# EAGLE design ps2st mouse v3 (EAGLE 7.4.0)
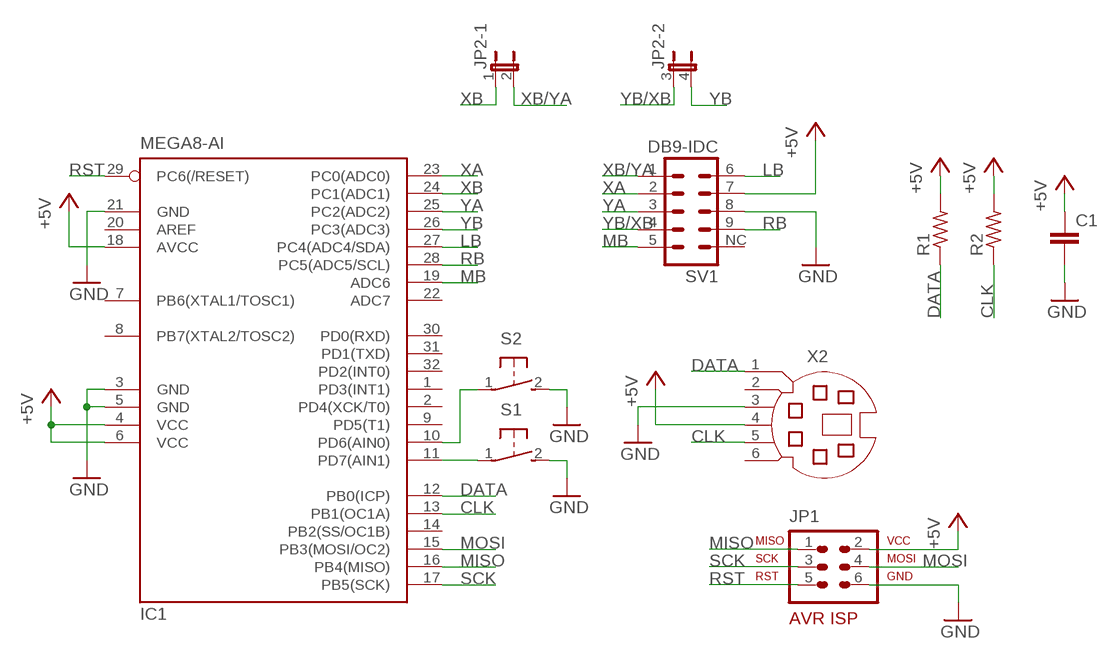
[diagram p0: schematic, sheet 1]

## Parts
C1  C-EUC0805  [C0805]
IC1  MEGA8-AI  [TQFP32-08]
JP1  AVR-ISP-6VERT  [AVR-ISP-6]
JP2  JP2QE  [JP2Q]
R1  R-US_R0805  [R0805]
R2  R-US_R0805  [R0805]
S1  3X6SWITCH  [3X6]
S2  3X6SWITCH  [3X6]
SV1  DB9-IDC  [DB9]
X2  MD06SS  [MDIN06SS]

## Nets
+5V [power]: C1.1 IC1.4(VCC) IC1.6(VCC) IC1.18(AVCC) JP1.2 R1.2 R2.2 SV1.7 X2.4
CLK: IC1.13(PB1(OC1A)) R2.1 X2.5
DATA: IC1.12(PB0(ICP)) R1.1 X2.1
GND [power]: C1.2 IC1.3(GND) IC1.5(GND) IC1.21(GND) JP1.6 S1.2(S) S2.2(S) SV1.8 X2.3
LB: IC1.27(PC4(ADC4/SDA)) SV1.6
MB [power]: IC1.19(ADC6) SV1.5
MISO: IC1.16(PB4(MISO)) JP1.1
MOSI: IC1.15(PB3(MOSI/OC2)) JP1.4
N$1: IC1.11(PD7(AIN1)) S1.1(P)
N$2: IC1.10(PD6(AIN0)) S2.1(P)
RB: IC1.28(PC5(ADC5/SCL)) SV1.9
RST: IC1.29(PC6(/RESET)) JP1.5
SCK: IC1.17(PB5(SCK)) JP1.3
XA: IC1.23(PC0(ADC0)) SV1.2
XB: IC1.24(PC1(ADC1)) JP2.1
XB/YA: JP2.2 SV1.1
YA: IC1.25(PC2(ADC2)) SV1.3
YB: IC1.26(PC3(ADC3)) JP2.4
YB/XB: JP2.3 SV1.4
Unconnected: IC1.1(PD3(INT1)) IC1.2(PD4(XCK/T0)) IC1.7(PB6(XTAL1/TOSC1)) IC1.8(PB7(XTAL2/TOSC2)) IC1.9(PD5(T1)) IC1.14(PB2(SS/OC1B)) IC1.20(AREF) IC1.22(ADC7) IC1.30(PD0(RXD)) IC1.31(PD1(TXD)) IC1.32(PD2(INT0)) SV1.NC X2.2 X2.6

## Library data of the parts
C1 = rcl:C-EU: CAPACITOR, European symbol
IC1 = atmel:MEGA8: MICROCONTROLLER 8 Kbytes FLASH, 1 kbytes SRAM, 512 bytes EEPROM, USART, 6-channel 10 bit ADC, 2-channel 8 bit ADC Pin compatible with Atmega48, ATMega88, ATMega168 Source: avr.lbr; MPN: ATMEGA8-16AU; OC_FARNELL: 9171371; OC_NEWARK: 73M8863
JP1 = avr-7:AVR-ISP-6: AVR ISP-6 Serial Programming Header
JP2 = jumper:JP2QE: JUMPER
R1 R2 = rcl:R-US_: RESISTOR, American symbol
S1 S2 = switch-omron:3X6SWITCH
SV1 = con-lstb:DB9-IDC
X2 = con-yamaichi:MD06SS: YAMAICHI CONNECTOR; OC_FARNELL: unknown; OC_NEWARK: unknown

## Net classes
1 power: width 0.508 mm

## Board
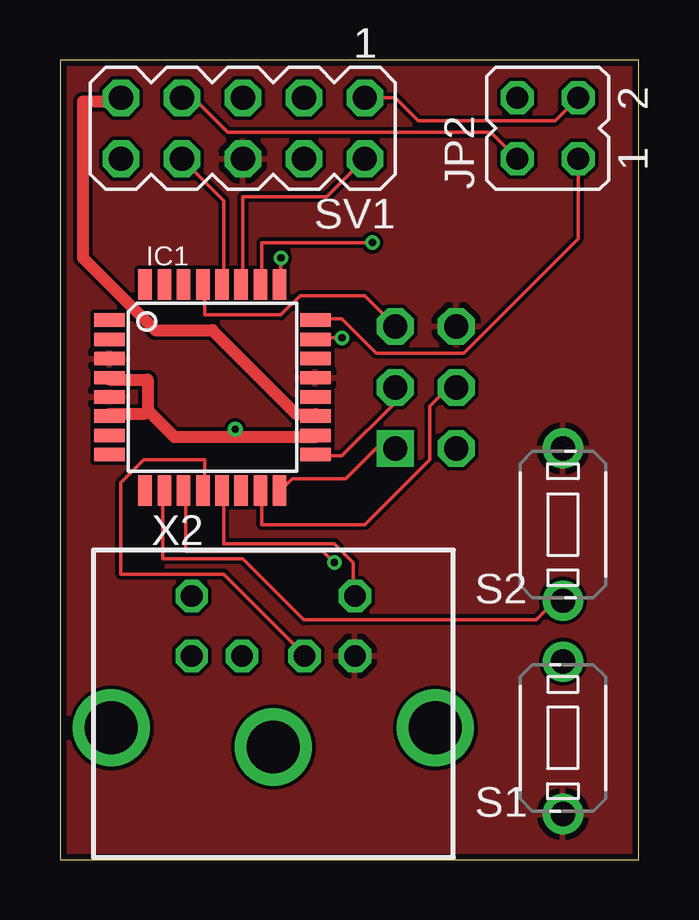
[diagram p1: board, top side]
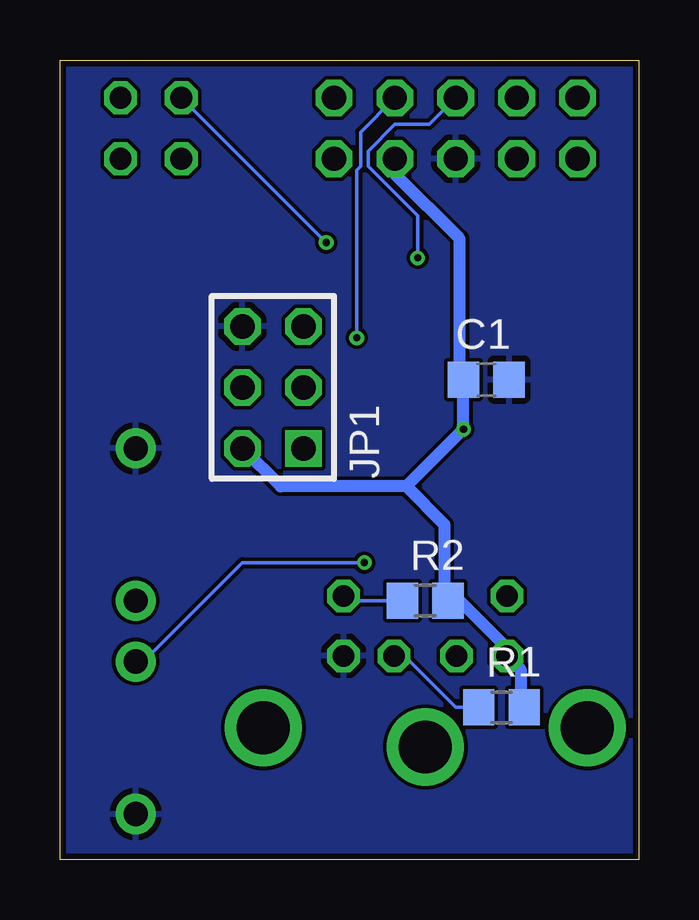
[diagram p2: board, bottom side, seen from below]

Size 24.11 x 33.33 mm. Coordinates in mm from the lower left corner, seen from the top.
Outline: 0,0 24.11,0 24.11,33.33 0,33.33 0,0
Copper layers (1*16): Top 0.035mm / dielectric 1.6mm / Bottom 0.035mm
Design rules "Elecrow_2-layer_PCB_eagle_rule *": minimum track width 6mil, minimum drill 12mil, track to track 6mil, track to pad 6mil, pad to pad 6mil, via to via 8mil, smd to smd 0mil, copper to edge 10mil, drill to drill 10mil, minimum pad ring 6mil, minimum via ring 6mil, stop-mask expansion 0mil, vias tented up to drill 100mil, thermal gap 10mil

### Footprints (pad centres in the part's own frame; a part is rotated, then mirrored left to right if it is on the bottom)
C0805 = smd 1.3 x 1.5: 1 -0.95,0; 2 0.95,0
TQFP32-08 = smd 1.27 x 0.559: 1 -4.293,2.8; 2 -4.293,2; 3 -4.293,1.2; 4 -4.293,0.4; 5 -4.293,-0.4; 6 -4.293,-1.2; 7 -4.293,-2; 8 -4.293,-2.8; 17 4.293,-2.8; 18 4.293,-2; 19 4.293,-1.2; 20 4.293,-0.4; 21 4.293,0.4; 22 4.293,1.2; 23 4.293,2; 24 4.293,2.8 | smd 0.559 x 1.27: 9 -2.8,-4.293; 10 -2,-4.293; 11 -1.2,-4.293; 12 -0.4,-4.293; 13 0.4,-4.293; 14 1.2,-4.293; 15 2,-4.293; 16 2.8,-4.293; 25 2.8,4.293; 26 2,4.293; 27 1.2,4.293; 28 0.4,4.293; 29 -0.4,4.293; 30 -1.2,4.293; 31 -2,4.293; 32 -2.8,4.293
AVR-ISP-6 = drill 1.016 square: 1 -2.54,-1.27 | drill 1.016 octagon: 2 -2.54,1.27; 3 0,-1.27; 4 0,1.27; 5 2.54,-1.27; 6 2.54,1.27
JP2Q = drill 0.914 octagon: 1 -1.27,-1.27; 2 1.27,-1.27; 3 -1.27,1.27; 4 1.27,1.27
R0805 = smd 1.3 x 1.5: 1 -0.95,0; 2 0.95,0
3X6 = drill 1.016 pad 1.676: 1 -3.175,0; 2 3.175,0
DB9 = drill 1.016 octagon: 1 -5.08,-1.27; 2 -2.54,-1.27; 3 0,-1.27; 4 2.54,-1.27; 5 5.08,-1.27; 6 -5.08,1.27; 7 -2.54,1.27; 8 0,1.27; 9 2.54,1.27; NC 5.08,1.27
MDIN06SS = drill 0.9 octagon: 1 1.3,8.5; 2 -1.3,8.5; 3 3.4,8.5; 4 -3.4,8.5; 5 3.4,11; 6 -3.4,11 | drill 2.2: P$1 -6.75,5.5; P$2 6.75,5.5; P$3 0,4.7

### Placement (x,y rotation side)
C1  6.35,20 0 bottom
IC1  6.35,19.68 0 top
JP1  15.24,19.68 90 bottom
JP2  20.32,30.48 90 top
R1  5.71,6.35 0 bottom
R2  8.89,10.79 0 bottom
S1  20.95,5.08 270 top
S2  20.95,13.97 90 top
SV1  7.62,30.48 180 top
X2  8.89,0 0 top

### Tracks (layer width: path | path; a pad name or v marks a point on that pad's centre or on a via)
+5V  (via drill 0.3)
  Top 0.508: 3.65,18.73 3.49,18.57 2.06,18.57 IC1.6 | 3.65,18.73 3.65,20 2.06,20 IC1.4 | 7.3,17.62 4.76,17.62 3.65,18.73 | 7.3,17.62 10.64,17.62 IC1.18 | v7.3,17.94 7.3,17.62
  Bottom 0.508: R1.2 4.92,6.35 4.92,7.94 5.4,8.41 X2.4 5.4,8.73 7.46,10.79 R2.2 8.1,10.95 8.1,13.97 9.68,15.56 | SV1.7 10.16,28.57 7.46,25.88 7.46,20.16 C1.1 v7.3,17.94 9.68,15.56 | JP1.2 14.92,15.56 9.68,15.56
CLK
  Top 0.152: IC1.13 6.83,15.24 6.83,13.18 11.43,13.18 12.22,12.38 12.22,11.11 X2.5
  Bottom 0.152: R2.1 12.06,10.79 12.22,10.95 X2.5
DATA
  Top 0.152: IC1.12 6.03,15.4 6.03,16.67 3.49,16.67 2.54,15.72 2.54,11.91 6.83,11.91 10.16,8.57 X2.1
  Bottom 0.152: R1.1 7.62,6.35 9.68,8.41 10.16,8.41 X2.1
GND
  pour Bottom: 0,0 26.67,0 26.67,33.66 0,33.66
  pour Top: -2.54,0 24.13,0 24.13,34.92 -2.54,34.92
LB
  Top 0.152: SV1.6 11.11,27.62 7.62,27.62 7.62,24.13 IC1.27
MB
  Top 0.508: SV1.5 2.38,31.59 0.95,31.59 0.95,25.08 3.97,22.07 6.35,22.07 9.84,18.57 10.64,18.57 IC1.19
MISO
  Top 0.152: JP1.1 13.18,17.14 11.91,15.88 9.68,15.88 9.21,15.4 IC1.16
MOSI
  Top 0.152: JP1.4 16.19,19.68 15.4,18.89 15.4,16.67 12.7,13.97 8.41,13.97 8.41,15.24 IC1.15
N$1  (via drill 0.3)
  Top 0.152: v11.43,12.38 10.95,12.86 5.24,12.86 5.24,15.24 IC1.11
  Bottom 0.152: v11.43,12.38 16.51,12.38 20.64,8.26 S1.1
N$2
  Top 0.152: S2.1 20.64,10.79 19.84,10 10.16,10 7.62,12.54 4.29,12.54 4.29,15.24 IC1.10
RB
  Top 0.152: SV1.9 6.83,27.46 6.83,24.13 IC1.28
RST
  Top 0.152: JP1.5 12.7,23.5 10,23.5 9.21,22.7 6.03,22.7 6.03,23.97 IC1.29
SCK
  Top 0.152: JP1.3 13.97,19.05 11.75,16.83 10.79,16.83 IC1.17
XA  (via drill 0.3)
  Top 0.152: v11.75,21.75 10.79,21.75 IC1.23
  Bottom 0.152: v11.75,21.75 11.75,28.73 11.59,28.89 11.59,30.32 SV1.2
XB
  Top 0.152: JP2.1 21.59,25.88 16.83,21.11 13.18,21.11 11.75,22.54 10.79,22.54 IC1.24
XB/YA
  Top 0.152: JP2.2 20.64,30.8 14.92,30.8 13.97,31.75 SV1.1
YA  (via drill 0.3)
  Top 0.152: v9.21,25.08 9.21,24.13 IC1.25
  Bottom 0.152: v9.21,25.08 9.21,26.83 11.27,28.89 11.27,29.53 10.16,30.64 8.73,30.64 SV1.3
YB  (via drill 0.3)
  Top 0.152: v13.02,25.72 8.41,25.72 8.41,24.13 IC1.26
  Bottom 0.152: JP2.4 v13.02,25.72
YB/XB
  Top 0.152: JP2.3 17.94,30.32 6.99,30.32 5.56,31.75 SV1.4